# EAGLE design giant-poe-pixel-controller-v1 (EAGLE 7.7.0)

## Sheet 1 of 2
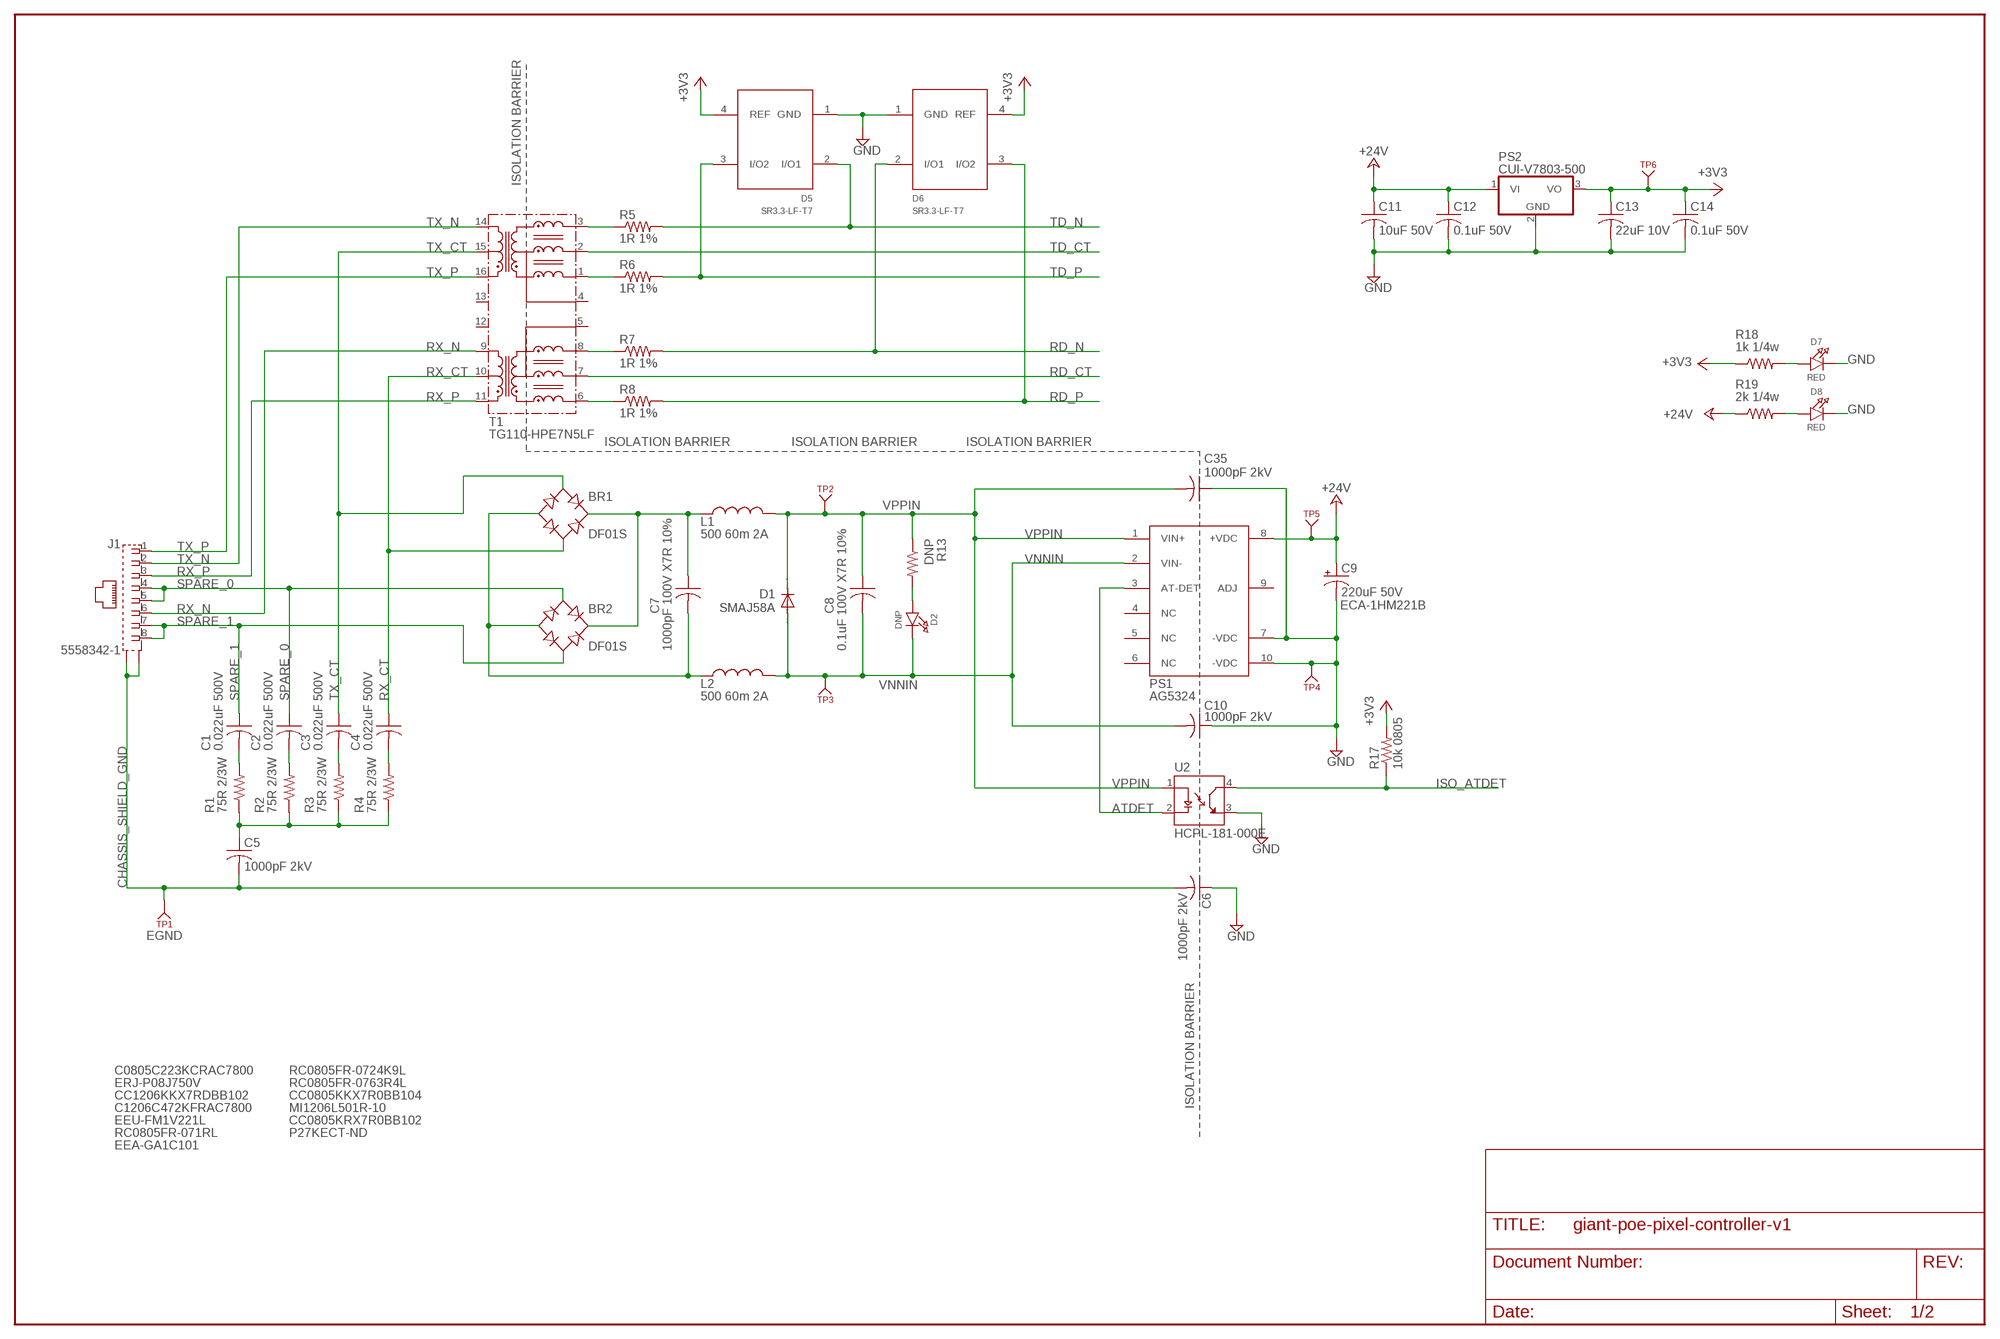
[diagram p0: schematic, sheet 1]

### Parts
BR1  DF01S  [DFS]
BR2  DF01S  [DFS]
C1  0.022uF 500V  C-USC1206  [C1206]
C2  0.022uF 500V  C-USC1206  [C1206]
C3  0.022uF 500V  C-USC1206  [C1206]
C4  0.022uF 500V  C-USC1206  [C1206]
C5  1000pF 2kV  C-USC1206K  [C1206K]
C6  1000pF 2kV  C-USC1206K  [C1206K]
C7  1000pF 100V X7R 10%  C-USC0805  [C0805]
C8  0.1uF 100V X7R 10%  C-USC0805  [C0805]
C9  220uF 50V  CPOL-USE5-10.5  [E5-10,5]
C10  1000pF 2kV  C-USC1206K  [C1206K]
C11  10uF 50V  C-USC1210K  [C1210K]
C12  0.1uF 50V  C-USC0805  [C0805]
C13  22uF 10V  C-USC1206K  [C1206K]
C14  0.1uF 50V  C-USC0805  [C0805]
C35  1000pF 2kV  C-USC1206K  [C1206K]
D1  SMAJ58A  DIODE-DO214AC  [DO214AC]
D2  DNP  LED0805_NOOUTLINE  [CHIPLED_0805_NOOUTLINE]
D5  SR3.3-LF-T7  [SOT143B]
D6  SR3.3-LF-T7  [SOT143B]
D7  RED  LED0805_NOOUTLINE  [CHIPLED_0805_NOOUTLINE]
D8  RED  LED0805_NOOUTLINE  [CHIPLED_0805_NOOUTLINE]
J1  5558342-1  [TE_5558342-1]
L1  500 60m 2A  L-USL3216C  [L3216C]
L2  500 60m 2A  L-USL3216C  [L3216C]
PS1  AG5324  [AG5324]
PS2  CUI-V7803-500  [CUI-78XX-500]
R1  75R 2/3W  R-US_R1206  [R1206]
R2  75R 2/3W  R-US_R1206  [R1206]
R3  75R 2/3W  R-US_R1206  [R1206]
R4  75R 2/3W  R-US_R1206  [R1206]
R5  1R 1%  R-US_R0805  [R0805]
R6  1R 1%  R-US_R0805  [R0805]
R7  1R 1%  R-US_R0805  [R0805]
R8  1R 1%  R-US_R0805  [R0805]
R13  DNP  R-US_R1206  [R1206]
R17  10k 0805  R-US_R0805  [R0805]
R18  1k 1/4w  R-US_R0805  [R0805]
R19  2k 1/4w  R-US_R0805  [R0805]
T1  TG110-HPE7N5LF  [RP-ULTRA]
TP1  KEYSTONE_500X  [KEYSTONE_TP500X]
TP2  KEYSTONE_500X  [KEYSTONE_TP500X]
TP3  KEYSTONE_500X  [KEYSTONE_TP500X]
TP4  KEYSTONE_500X  [KEYSTONE_TP500X]
TP5  KEYSTONE_500X  [KEYSTONE_TP500X]
TP6  KEYSTONE_500X  [KEYSTONE_TP500X]
U2  HCPL-181-000E  [SOIC254P675X240-4N]

### Nets
+3V3: C13.1 C14.1 D5.4(REF) D6.4(REF) PS2.3(VO) R17.2 R18.1 TP6.1 ; also sheet 2
+24V: C9.+ C11.1 C12.1 PS1.8(+VDC) PS2.1(VI) R19.1 TP5.1 ; also sheet 2
ATDET: PS1.3(AT-DET) U2.2(CATHODE)
CHASSIS_SHIELD_GND: C5.2 C6.2 J1.SH1(S1) J1.SH2(S2) TP1.1
GND: C6.1 C9.- C10.1 C11.2 C12.2 C13.2 C14.2 C35.1 D5.1(GND) D6.1(GND) D7.C D8.C PS1.7(-VDC) PS1.10(-VDC) PS2.2(GND) TP4.1 U2.3(EMITTER) ; also sheet 2
ISO_ATDET: R17.1 U2.4(COLLECTOR) ; also sheet 2
N$1: BR1.+ BR2.+ C7.1 L1.1
N$2: R5.1 T1.3
N$3: BR1.- BR2.- C7.2 L2.1
N$4: R6.1 T1.1
N$5: C4.2 R4.2
N$6: R7.1 T1.8
N$7: D2.A R13.2
N$13: R8.1 T1.6
N$14: C1.2 R1.2
N$15: C2.2 R2.2
N$16: C3.2 R3.2
N$17: C5.1 R1.1 R2.1 R3.1 R4.1
N$24: D7.A R18.2
N$25: D8.A R19.2
RD_CT: T1.7 ; also sheet 2
RD_N: D6.2(I/O1) R7.2 ; also sheet 2
RD_P: D6.3(I/O2) R8.2 ; also sheet 2
RX_CT: BR1.AC2 C4.1 T1.10
RX_N: J1.6 T1.9
RX_P: J1.3 T1.11
SPARE_0: BR2.AC1 C2.1 J1.4 J1.5
SPARE_1: BR2.AC2 C1.1 J1.7 J1.8
TD_CT: T1.2 ; also sheet 2
TD_N: D5.2(I/O1) R5.2 ; also sheet 2
TD_P: D5.3(I/O2) R6.2 ; also sheet 2
TX_CT: BR1.AC1 C3.1 T1.15
TX_N: J1.2 T1.14
TX_P: J1.1 T1.16
VNNIN: C8.2 C10.2 D1.A D2.C L2.2 PS1.2(VIN-) TP3.1
VPPIN: C8.1 C35.2 D1.C L1.2 PS1.1(VIN+) R13.1 TP2.1 U2.1(ANODE)
Unconnected: PS1.4(NC) PS1.5(NC) PS1.6(NC) PS1.9(ADJ) T1.4 T1.5 T1.12 T1.13

### Notes on the sheet
- ISOLATION BARRIER
- ISOLATION BARRIER | ISOLATION BARRIER | ISOLATION BARRIER
- ECA-1HM221B
- EGND
- C0805C223KCRAC7800 | RC0805FR-0724K9L
- ERJ-P08J750V | RC0805FR-0763R4L
- CC1206KKX7RDBB102 | CC0805KKX7R0BB104
- ISOLATION BARRIER
- C1206C472KFRAC7800 | MI1206L501R-10
- EEU-FM1V221L | CC0805KRX7R0BB102
- RC0805FR-071RL | P27KECT-ND
- EEA-GA1C101

## Sheet 2 of 2
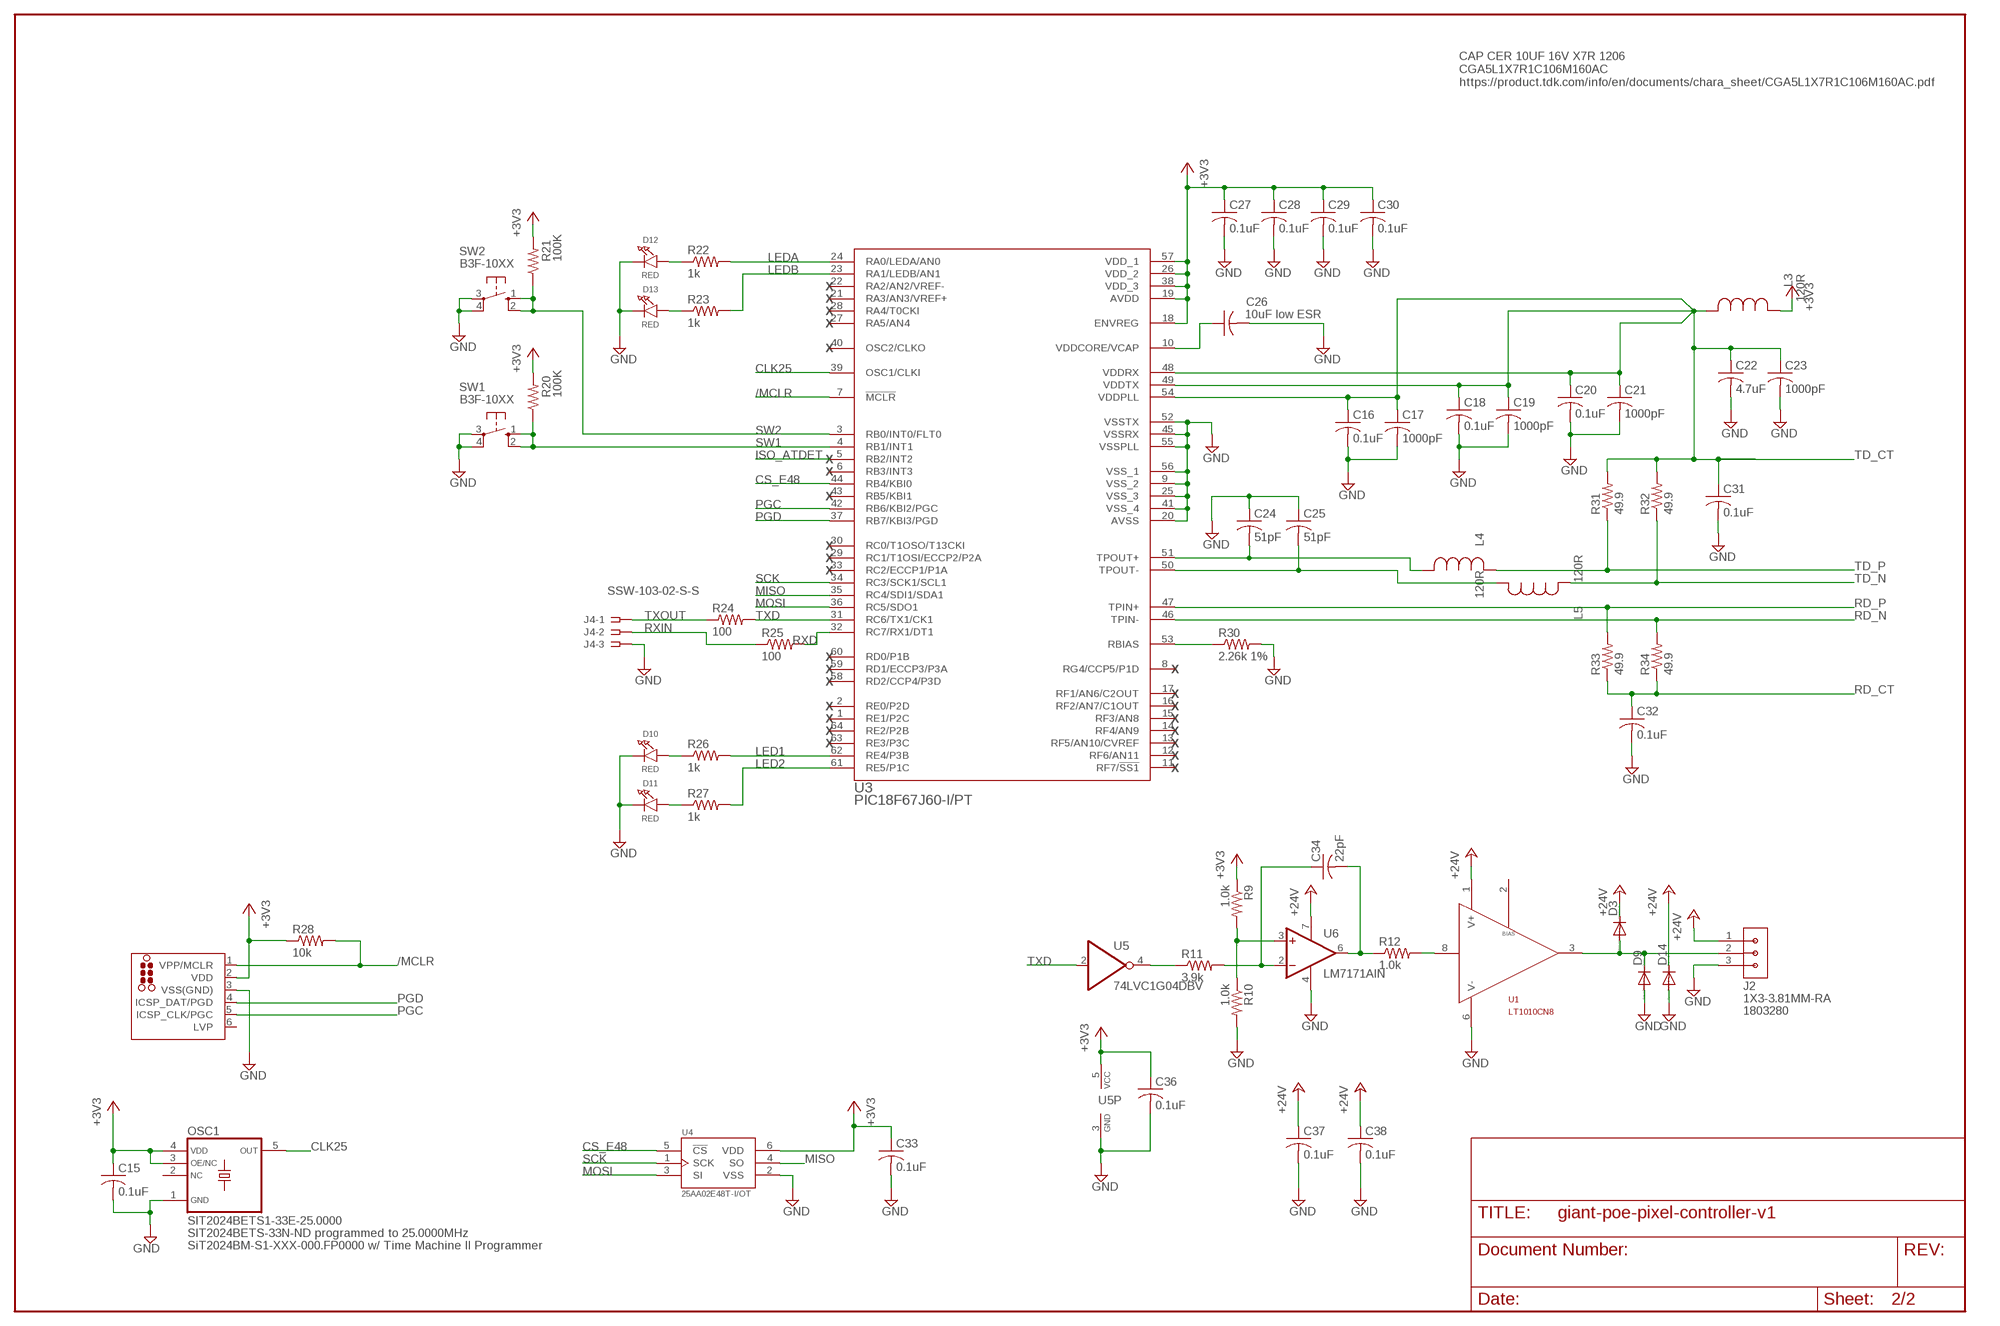
[diagram p1: schematic, sheet 2]

### Parts
C15  0.1uF  C-USC0603  [C0603]
C16  0.1uF  C-USC0805  [C0805]
C17  1000pF  C-USC0805  [C0805]
C18  0.1uF  C-USC0805  [C0805]
C19  1000pF  C-USC0805  [C0805]
C20  0.1uF  C-USC0805  [C0805]
C21  1000pF  C-USC0805  [C0805]
C22  4.7uF  C-USC0805  [C0805]
C23  1000pF  C-USC0805  [C0805]
C24  51pF  C-USC0805  [C0805]
C25  51pF  C-USC0805  [C0805]
C26  10uF low ESR  C-USC1206  [C1206]
C27  0.1uF  C-USC0603  [C0603]
C28  0.1uF  C-USC0603  [C0603]
C29  0.1uF  C-USC0603  [C0603]
C30  0.1uF  C-USC0603  [C0603]
C31  0.1uF  C-USC0805  [C0805]
C32  0.1uF  C-USC0805  [C0805]
C33  0.1uF  C-USC0603  [C0603]
C34  22pF  C-USC0805  [C0805]
C36  0.1uF  C-USC0603  [C0603]
C37  0.1uF  C-USC0603  [C0603]
C38  0.1uF  C-USC0603  [C0603]
D3  DIODE-SOD123  [SOD123]
D9  DIODE-SOD123  [SOD123]
D10  RED  LED0805_NOOUTLINE  [CHIPLED_0805_NOOUTLINE]
D11  RED  LED0805_NOOUTLINE  [CHIPLED_0805_NOOUTLINE]
D12  RED  LED0805_NOOUTLINE  [CHIPLED_0805_NOOUTLINE]
D13  RED  LED0805_NOOUTLINE  [CHIPLED_0805_NOOUTLINE]
D14  DIODE-SOD123  [SOD123]
J2  1X3-3.81MM-RA  CON-3.81MM-1X3-PHOENIX-RA  [CON-PHOENIX-3.81-1X3-RA]
J3  TC2030-MCP-NL  [TC2030-MCP-NL]
J4  SSW-103-02-S-S  [SSW-103-02-S-S]
L3  120R  MMZ1608B121CTAH0IND_1608-M  [IND_1608-M]
L4  120R  MMZ1608B121CTAH0IND_1608-M  [IND_1608-M]
L5  120R  MMZ1608B121CTAH0IND_1608-M  [IND_1608-M]
OSC1  SIT2024BETS1-33E-25.0000  SIT2024BETS1-33E-10.0000  [SOT23-5]
R9  1.0k  R-US_R0805  [R0805]
R10  1.0k  R-US_R0805  [R0805]
R11  3.9k  R-US_R0805  [R0805]
R12  1.0k  R-US_R0805  [R0805]
R20  100K  R-US_R0805  [R0805]
R21  100K  R-US_R0805  [R0805]
R22  1k  R-US_R0805  [R0805]
R23  1k  R-US_R0805  [R0805]
R24  100  R-US_R0805  [R0805]
R25  100  R-US_R0805  [R0805]
R26  1k  R-US_R0805  [R0805]
R27  1k  R-US_R0805  [R0805]
R28  10k  R-US_R0805  [R0805]
R30  2.26k 1%  R-US_R0805  [R0805]
R31  49.9  R-US_R0805  [R0805]
R32  49.9  R-US_R0805  [R0805]
R33  49.9  R-US_R0805  [R0805]
R34  49.9  R-US_R0805  [R0805]
SW1  B3F-10XX  10-XX  [B3F-10XX]
SW2  B3F-10XX  10-XX  [B3F-10XX]
U1  LT1010CN8  [DIL08]
U3  PIC18F67J60-I/PT  [TQFP64_10X10MC]
U4  25AA02E48T-I/OT  [SOT95P270X145-6N]
U5  74LVC1G04DBV  [SOT23-5]
U6  LM7171AIN  LM307D  [SO08]

### Nets
+3V3: C15.1 C27.1 C28.1 C29.1 C30.1 C33.1 C36.1 J3.2(VDD) L3.2 OSC1.3(OE/NC) OSC1.4(VDD) R9.1 R20.2 R21.2 R28.1 U3.18(ENVREG) U3.19(AVDD) U3.26(VDD_2) U3.38(VDD_3) U3.57(VDD_1) U4.6(VDD) U5.5(VCC) ; also sheet 1
+24V: C37.1 C38.1 D3.C D14.C J2.1 U1.1(V+) U6.7(V+) ; also sheet 1
/MCLR: J3.1(VPP/MCLR) R28.2 U3.7(!MCLR)
CLK25: OSC1.5(OUT) U3.39(OSC1/CLKI)
CS_E48: U3.44(RB4/KBI0) U4.5(!CS)
GND: C15.2 C16.2 C17.2 C18.2 C19.2 C20.2 C21.2 C22.2 C23.2 C24.1 C25.1 C26.2 C27.2 C28.2 C29.2 C30.2 C31.2 C32.2 C33.2 C36.2 C37.2 C38.2 D9.A D10.C D11.C D12.C D13.C D14.A J2.3 J3.3(VSS(GND)) J4.3 OSC1.1(GND) R10.2 R30.2 SW1.3(P) SW1.4(P1) SW2.3(P) SW2.4(P1) U1.6(V-) U3.9(VSS_2) U3.20(AVSS) U3.25(VSS_3) U3.41(VSS_4) U3.45(VSSRX) U3.52(VSSTX) U3.55(VSSPLL) U3.56(VSS_1) U4.2(VSS) U5.3(GND) U6.4(V-) ; also sheet 1
ISO_ATDET: U3.5(RB2/INT2) ; also sheet 1
LED1: R26.2 U3.62(RE4/P3B)
LED2: R27.2 U3.61(RE5/P1C)
LEDA: R22.2 U3.24(RA0/LEDA/AN0)
LEDB: R23.2 U3.23(RA1/LEDB/AN1)
MISO: U3.35(RC4/SDI1/SDA1) U4.4(SO)
MOSI: U3.36(RC5/SDO1) U4.3(SI)
N$8: R11.1 U5.4(O)
N$9: R30.1 U3.53(RBIAS)
N$10: D13.A R23.1
N$11: D10.A R26.1
N$18: D11.A R27.1
N$19: C34.1 R11.2 U6.2(-IN)
N$20: R9.2 R10.1 U6.3(+IN)
N$21: D12.A R22.1
N$22: C34.2 R12.1 U6.6(OUT)
N$28: D3.A D9.C J2.2 U1.3(OUTPUT)
N$29: R12.2 U1.8(INPUT)
PGC: J3.5(ICSP_CLK/PGC) U3.42(RB6/KBI2/PGC)
PGD: J3.4(ICSP_DAT/PGD) U3.37(RB7/KBI3/PGD)
RD_CT: C32.1 R33.1 R34.1 ; also sheet 1
RD_N: R34.2 U3.46(TPIN-) ; also sheet 1
RD_P: R33.2 U3.47(TPIN+) ; also sheet 1
RXD: R25.2 U3.32(RC7/RX1/DT1)
RXIN: J4.2 R25.1
SCK: U3.34(RC3/SCK1/SCL1) U4.1(SCK)
SW1: R20.1 SW1.1(S) SW1.2(S1) U3.4(RB1/INT1)
SW2: R21.1 SW2.1(S) SW2.2(S1) U3.3(RB0/INT0/FLT0)
TD_CT: C16.1 C17.1 C18.1 C19.1 C20.1 C21.1 C22.1 C23.1 C31.1 L3.1 R31.2 R32.2 U3.48(VDDRX) U3.49(VDDTX) U3.54(VDDPLL) ; also sheet 1
TD_N: L5.2 R32.1 ; also sheet 1
TD_P: L4.2 R31.1 ; also sheet 1
TDF_N: C25.2 L5.1 U3.50(TPOUT-)
TDF_P: C24.2 L4.1 U3.51(TPOUT+)
TXD: R24.2 U3.31(RC6/TX1/CK1) U5.2(I)
TXOUT: J4.1 R24.1
VDDCORE: C26.1 U3.10(VDDCORE/VCAP)
Unconnected: J3.6(LVP) OSC1.2(NC) U1.2(BIAS) U3.1(RE1/P2C) U3.2(RE0/P2D) U3.6(RB3/INT3) U3.8(RG4/CCP5/P1D) U3.11(RF7/!SS1) U3.12(RF6/AN11) U3.13(RF5/AN10/CVREF) U3.14(RF4/AN9) U3.15(RF3/AN8) U3.16(RF2/AN7/C1OUT) U3.17(RF1/AN6/C2OUT) U3.21(RA3/AN3/VREF+) U3.22(RA2/AN2/VREF-) U3.27(RA5/AN4) U3.28(RA4/T0CKI) U3.29(RC1/T1OSI/ECCP2/P2A) U3.30(RC0/T1OSO/T13CKI) U3.33(RC2/ECCP1/P1A) U3.40(OSC2/CLKO) U3.43(RB5/KBI1) U3.58(RD2/CCP4/P3D) U3.59(RD1/ECCP3/P3A) U3.60(RD0/P1B) U3.63(RE3/P3C) U3.64(RE2/P2B)

### Notes on the sheet
- CAP CER 10UF 16V X7R 1206
  CGA5L1X7R1C106M160AC 
  https://product.tdk.com/info/en/documents/chara_sheet/CGA5L1X7R1C106M160AC.pdf
- X
- X
- X
- X
- X
- X
- X
- X
- X
- X
- X
- X
- X | X
- X
- X
- X | X
- X | X
- X | X
- X | X
- X
- X
- SIT2024BETS-33N-ND programmed to 25.0000MHz
- SiT2024BM-S1-XXX-000.FP0000 w/ Time Machine II Programmer

## Library data of the parts
BR1 BR2 = rectifier:DF*S: Surface Mount Glass Passivated Bridge Rectifiers Source: Source: Comchip Bridge Rectifiers DF005S-G thru DF10S-G.pdf
C1-C8 C10 C15-C25 C27-C38 = rcl:C-US: CAPACITOR, American symbol
C9 = rcl:CPOL-US: POLARIZED CAPACITOR, American symbol
C11 = rcl:C-US: CAPACITOR, American symbol; MFR: KEMET; MFR_PART_NO: C1210C106K5RACTU
C12 C14 = rcl:C-US: CAPACITOR, American symbol; MFR: KEMET; MFR_PART_NO: C1206S104M5RACTU
C13 = rcl:C-US: CAPACITOR, American symbol; MFR: KEMET; MFR_PART_NO: C1206C226K8RAC7800
C26 = resistor:C-US: CAPACITOR, American symbol
D1 D3 D9 D14 = diode:DIODE-: DIODE
D2 D7 D8 D10-D13 = microbuilder:LED: LED 0603 - 0603 Surface Mount Package 2mA: Green LED - Low Power (3.9mcd, 2ma, 1.7Vf) - Digikey: 475-2709-2-ND Orange LED - Low Power (9.8mcd, 2ma, 1.8Vf) - Digikey: 475-1194-2-ND Red LED - Low Power (5mcd, 2ma, 1.8Vf) - Digikey: 475-1195-2-ND Yellow LED - Low Power (7mcd, 2ma, 1.8Vf) - Digikey: 475-1196-2-ND 5mA: Blue LED - Low Power (17mcd, 5ma, 2.9Vf) - Digikey: LNJ937W8CRACT-ND 0805 - 0805 Surface Mount Package 2mA: Red LED (8.8mcd, 2mA, 1.8Vf, Clear) - Low Power [Digikey: 475-2510-1-ND] Green LED (5mcd, 2mA, 1.8Vf, Clear) - Low Power [Digikey: 475-2730-1-ND] Yellow LED (11.3mcd, 2mA, 1.8Vf, Clear) - Low Power [Digikey: 475-2555-1-ND] 20mA: Red LED (104mcd, 20mA, Diffused) - LS R976 [Digikey: 475-1278-6-ND] Red LED (12mcd, 20mA, 2.0Vf, Clear) - APT2012EC [Digikey: 754-1128-1-ND] Green LED (15mcd, 20mA, 2.2Vf, Clear) - APT2012GC [Digikey: 754-1131-1-ND] Orange LED (160mcd, 20mA, 2.1Vf, Clear) - APT2012SECK [Digikey: 754-1130-1-ND] 1206 - 1206 Surface Mount Package Green LED (26mcd, 20mA, Diffused) - LG N971 [Digikey: 475-1407-6-ND] Red LED (15mcd, 20mA, Diffused) - LH N974 [Digikey: 475-1416-6-ND] Cree - Cree High-Power Surface Mount LEDs XPEBWT-L1-0000-00D50 - White 111lm 350mA 2.9Vf 6200K 110° XTEAWT-00-0000-00000LEE3 - White 114lm 350mA 2.85Vf 5000K 115° Everlight - Everlight 45-21 Series Surface Mount LEDs 45-21/QK2C-B2832AC2CB2/2T - Warm White 2000mcd 20mA 3.25Vf 3050K 120° 45-21/LK2C-B38452C4CB2/2T - Nuetral White 2000mcd 20mA 3.25Vf 4150K 120° 45-21/LK2C-B50634C6CB2/2T - Cold White 2200mcd 20mA 3.25Vf 5650K 120° PLCC2 Reverse Mount LS T77K-J1L2-1-0-2-R18-Z - Red 11.25mcd 2mA 1.8Vf 630nm 120° LO T77K-L1M2-24-Z - Orange 19.6mcd 2mA 1.8Vf 606nm 120° LY T77K-K2M1-26-Z - Yellow 15.7mcd 2mA 1.8Vf 587nm 120°
D5 D6 = protek-devices:SR3.3-LF-T7
J1 = 5558342-1:5558342-1: CONN MOD JACK 8P8C R/A SHIELDED; COMMENT: 5558342-1; DESCRIPTION: Conn RJ-45 F 8 POS 2.54mm Solder RA Thru-Hole 8 Terminal 1 Port Cat 5 Box/Tray; DIGI-KEY_PART_NUMBER: A31466-ND; DIGI-KEY_PURCHASE_URL: https://www.digikey.com/product-detail/en/te-connectivity-amp-connectors/5558342-1/A31466-ND/769610?utm_source=snapeda&utm_medium=aggregator&utm_campaign=symbol; EU_ROHS_COMPLIANCE: Compliant; MF: TE Connectivity; MP: 5558342-1; PACKAGE: None; TE_PURCHASE_URL: https://www.te.com/usa-en/product-5558342-1.html?te_bu=Cor&te_type=disp&te_campaign=seda_glo_cor-seda-global-disp-prtnr-fy19-seda-model-bom-cta_sma-317_1&elqCampaignId=32493
J2 = 0GlenConnectors:CON-3.81MM-1X3-PHOENIX-RA; MATES_WITH: 1803581; MFR: PHOENIX; MFR_PART_NO: 1803280
J3 = tag-connect:TC2030: TAG-CONNECT ICSP Connector Manufacturer: Tag-Connect <http://www.tag-connect.com> Cable for easy In-Circuit Serial Programming. Designed for Microchip ICD2, suitable for many others. Two variants - one "with legs" (for hands-free fit on PCB) and another "without legs" for quick programming. PAD Description 1 MCLR/Vpp 2 Vdd 3 GND 4 PGD (ISPDAT) 5 PGC (ISPCLK) 6 nc (used for LVP) ©2009 ROFA.cz - modified and updated by Robert Darlington ‹rdarlington@gmail.com›
J4 = con-samtec:SSW-103-02-S-S: THROUGH-HOLE .025" SQ POST SOCKET Source: Samtec SSW.pdf; MPN: SSW-103-02-S-S; OC_FARNELL: unknown; OC_NEWARK: 11P9367
L1 L2 = rcl:L-US: INDUCTOR, American symbol
L3-L5 = MMZ1608B121CTAH0:MMZ1608B121CTAH0; BUILT_BY: EMA_UL_Team; MANUFACTURER_PART_NUMBER: MMZ1608B121CTAH0; VENDOR: TDK
OSC1 = Glen-SiTime:SIT2024BETS1-33E-10.0000
PS1 = silvertel:AG5324
PS2 = GlenPartsLibrary:CUI-V7803-500
R1-R13 R18-R28 R30-R34 = rcl:R-US_: RESISTOR, American symbol
R17 = resistor:R-US_: RESISTOR, American symbol
SW1 SW2 = switch-omron:10-XX: OMRON SWITCH
T1 = halo-rp-ultra-magnetics:TG110-HPE7N5LF
TP1-TP6 = 0GlenConnectors:KEYSTONE_500X
U1 = GlenPartsLibrary:LT1010CN8
U2 = HCPL-181-000E:HCPL-181-000E: Optocoupler; SMD; Channels: 1; Out: transistor; Uinsul: 3.75kV; SO4; DESCRIPTION: Optocoupler; SMD; Channels: 1; Out: transistor; Uinsul: 3.75kV; SO4; DIGI-KEY_PART_NUMBER: 516-1646-1-ND; DIGI-KEY_PURCHASE_URL: https://www.digikey.com/product-detail/en/broadcom-limited/HCPL-181-000E/516-1646-1-ND/825340?utm_source=snapeda&utm_medium=aggregator&utm_campaign=symbol; MF: Broadcom Limited; MP: HCPL-181-000E; PACKAGE: SO-4 Broadcom
U3 = pic18f67j60:PIC18F67J60-I/PT; MANUFACTURER_PART_NUMBER: PIC18F67J60IPT; VENDOR: Microchip
U4 = 25AA02E48T-I_OT:25AA02E48T-I/OT: 25AA02E48 Series 2 Kbit (256 x 8) 5.5 V SMT SPI Bus Serial EEPROM - SOT-23-6; DESCRIPTION: 25AA02E48 Series 2 Kbit _256 x 8_ 5.5 V SMT SPI Bus Serial EEPROM - SOT-23-6; DIGI-KEY_PART_NUMBER: 25AA02E48T-I/OTCT-ND; DIGI-KEY_PURCHASE_URL: https://www.digikey.com/product-detail/en/microchip-technology/25AA02E48T-I-OT/25AA02E48T-I-OTCT-ND/2060055?utm_source=snapeda&utm_medium=aggregator&utm_campaign=symbol; MF: Microchip; MP: 25AA02E48T-I/OT; PACKAGE: SOT-23-6 Microchip
U5 = 74xx-little-de:74*1G04: INVERTER Gate
U6 = linear:LM307: OP AMP

## Board
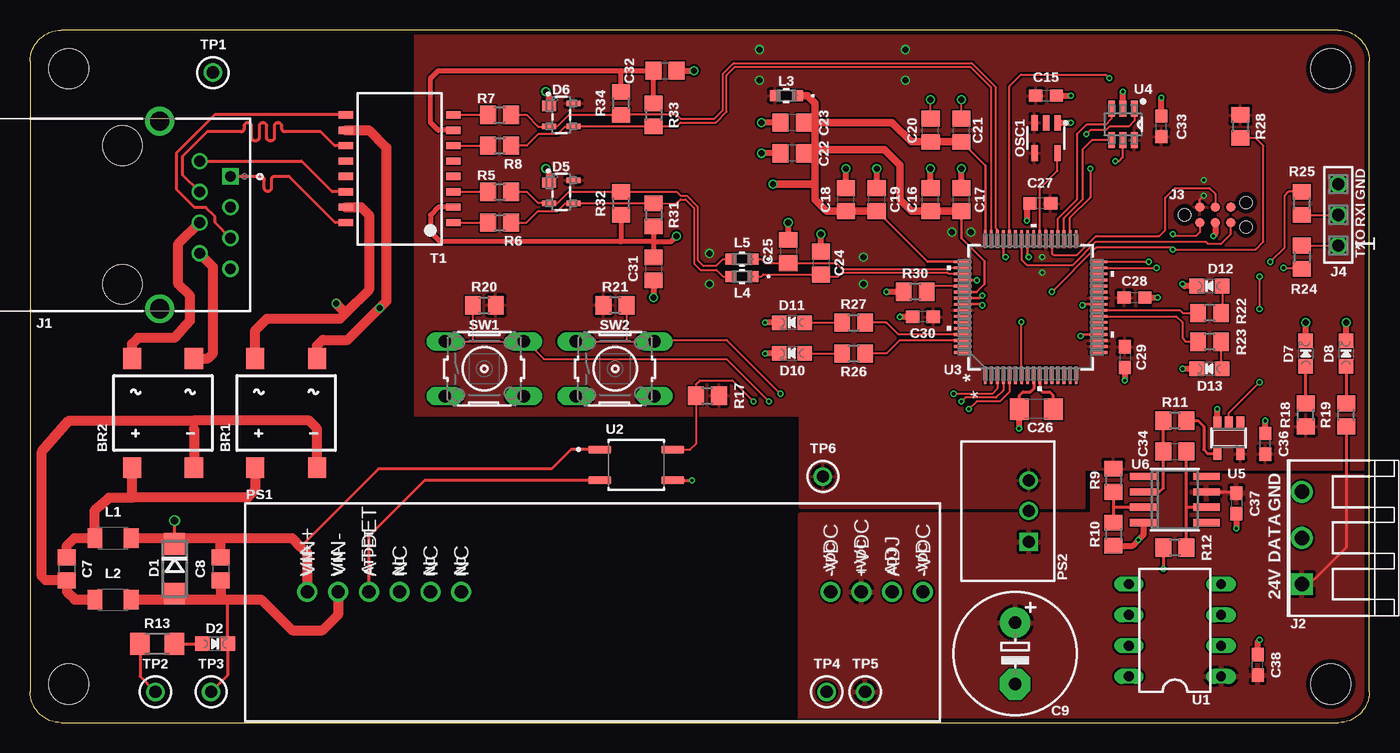
[diagram p2: board, top side]
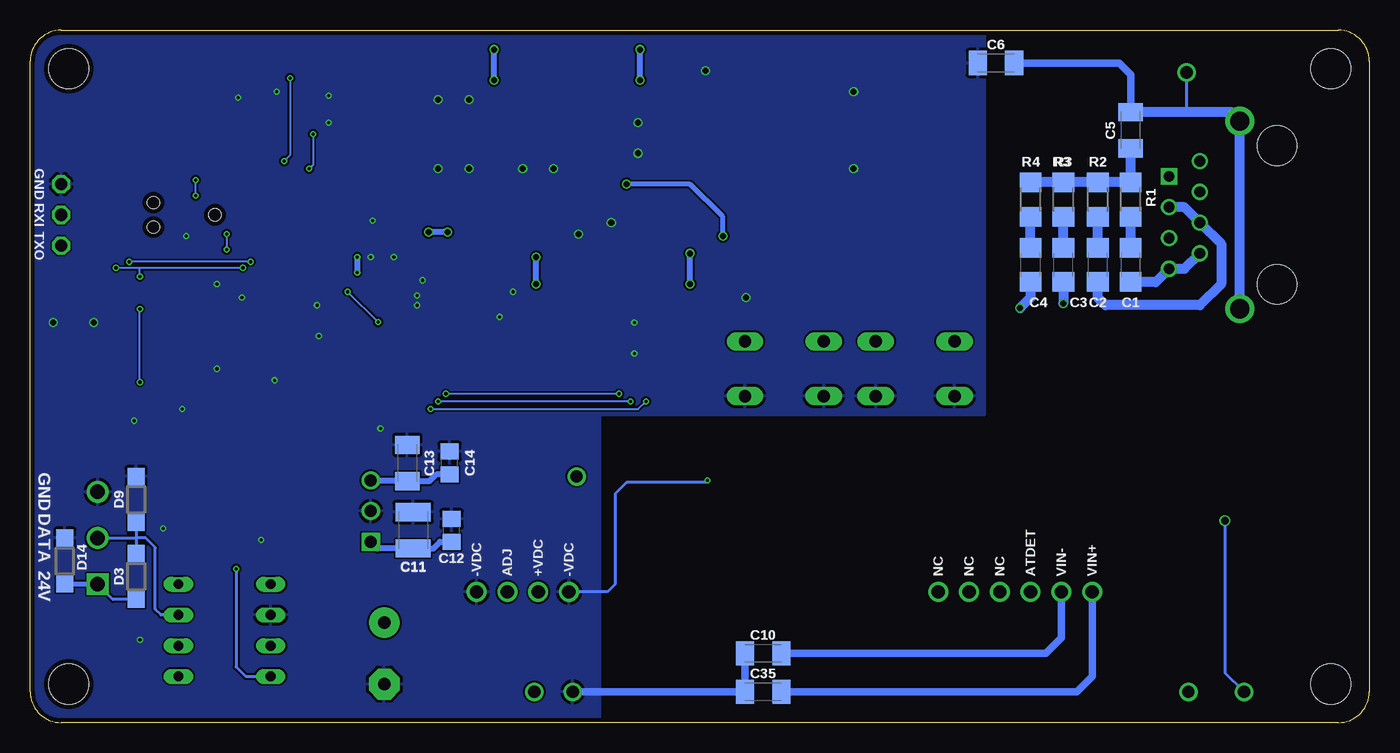
[diagram p3: board, bottom side, seen from below]

Size 110.49 x 57.15 mm. Coordinates in mm from the lower left corner, seen from the top.
Outline: 2.54,0 107.95,0 arc90 110.49,2.54 110.49,54.61 arc90 107.95,57.15 2.54,57.15 arc90 0,54.61 0,2.54 arc90 2.54,0
Copper layers (1*16): Top 0.035559375mm / dielectric 1.6mm / Bottom 0.035559375mm
Design rules "oshpark-2layer-2018": minimum track width 6mil, minimum drill 10mil, track to track 6mil, track to pad 6mil, pad to pad 6mil, via to via 6mil, smd to smd 6mil, copper to edge 15mil, drill to drill 6mil, minimum pad ring 5mil, minimum via ring 5mil, stop-mask expansion 2.5mil, vias tented up to drill 0mil, thermal gap 10mil
Holes 3.3 mm at 3.17,3.17 107.31,53.98 3.17,53.98 107.31,3.17

### Footprints (pad centres in the part's own frame; a part is rotated, then mirrored left to right if it is on the bottom)
DFS = smd 1.5 x 1.7: + -2.55,-4.5; - 2.55,-4.5; AC1 -2.55,4.5; AC2 2.55,4.5
C1206 = smd 1.6 x 1.8: 1 -1.4,0; 2 1.4,0
C1206K = smd 1.5 x 2: 1 -1.5,0; 2 1.5,0
C0805 = smd 1.3 x 1.5: 1 -0.95,0; 2 0.95,0
E5-10,5 = drill 1.016 pad 2.54: + -2.54,0 | drill 1.016 pad 2.54 octagon: - 2.54,0
C1210K = smd 1.5 x 2.9: 1 -1.5,0; 2 1.5,0
C0603 = smd 1.1 x 1: 1 -0.85,0; 2 0.85,0
DO214AC = smd 1.8 x 1.7: A 2.05,0; C -2.05,0
CHIPLED_0805_NOOUTLINE = smd 1.2 x 1.2: A 0,-1.05; C 0,1.05
SOD123 = smd 1.4 x 1.4: A 1.9,0; C -1.9,0
SOT143B = smd 0.838 x 1.168: 1 -0.747,-1.016 | smd 0.432 x 1.168: 2 0.95,-1.016; 3 0.95,1.016; 4 -0.95,1.016
TE_5558342-1 = drill 0.89 square: 1 -3.175,8.89 | drill 0.89: 2 -4.445,6.35; 3 -1.905,6.35; 4 0.635,6.35; 5 -0.635,8.89; 6 1.905,8.89; 7 4.445,8.89; 8 3.175,6.35 | drill 1.58: SH1 -7.745,3.05; SH2 7.745,3.05 | hole 3.25: -5.715,0; 5.715,0
CON-PHOENIX-3.81-1X3-RA = drill 1.2 square: 1 0,0 | drill 1.2: 2 3.81,0; 3 7.62,0
TC2030-MCP-NL = smd 0.787 x 0.787: 1 1.27,-0.635; 2 1.27,0.635; 3 2.54,-0.635; 4 2.54,0.635; 5 3.81,-0.635; 6 3.81,0.635 | hole 0.991: 0,0; 5.08,-1.016; 5.08,1.016
SSW-103-02-S-S = drill 1 pad 1.5 octagon: 1 -2.54,0; 2 0,0; 3 2.54,0
L3216C = smd 1.2 x 1.6: 1 -1.5,0; 2 1.5,0
IND_1608-M = smd 0.859 x 0.902: 1 -0.929,0; 2 0.929,0
SOT23-5 = smd 1.3 x 0.55: 1 -1.25,0.95; 2 -1.25,0; 3 -1.25,-0.95; 4 1.25,-0.95; 5 1.25,0.95
AG5324 = drill 1.1: 1 0,0; 2 2.54,0; 3 5.08,0; 4 7.62,0; 5 10.16,0; 6 12.7,0; 7 43.18,0; 8 45.72,0; 9 48.26,0; 10 50.8,0
CUI-78XX-500 = drill 1 square: 1 0,0 | drill 1: 2 2.54,0; 3 5.08,0
R1206 = smd 1.6 x 1.803: 1 -1.422,0; 2 1.422,0
R0805 = smd 1.3 x 1.5: 1 -0.95,0; 2 0.95,0
B3F-10XX = drill 1.016 long: 1 -3.251,2.261; 2 3.251,2.261; 3 -3.251,-2.261; 4 3.251,-2.261
RP-ULTRA = smd 0.6 x 1.2: 1 -4.445,-4.445; 2 -3.175,-4.445; 3 -1.905,-4.445; 4 -0.635,-4.445; 5 0.635,-4.445; 6 1.905,-4.445; 7 3.175,-4.445; 8 4.445,-4.445; 9 4.445,4.445; 10 3.175,4.445; 11 1.905,4.445; 12 0.635,4.445; 13 -0.635,4.445; 14 -1.905,4.445; 15 -3.175,4.445; 16 -4.445,4.445
KEYSTONE_TP500X = drill 1.016: 1 0,0
DIL08 = drill 0.813 long: 1 -3.81,-3.81; 2 -1.27,-3.81; 3 1.27,-3.81; 4 3.81,-3.81; 5 3.81,3.81; 6 1.27,3.81; 7 -1.27,3.81; 8 -3.81,3.81
SOIC254P675X240-4N = smd 1.89 x 0.59: 1 -3.01,1.27; 2 -3.01,-1.27; 3 3.01,-1.27; 4 3.01,1.27
TQFP64_10X10MC = smd 1.473 x 0.229: 1 -5.613,3.75; 2 -5.613,3.25; 3 -5.613,2.75; 4 -5.613,2.25; 5 -5.613,1.75; 6 -5.613,1.25; 7 -5.613,0.75; 8 -5.613,0.25; 9 -5.613,-0.25; 10 -5.613,-0.75; 11 -5.613,-1.25; 12 -5.613,-1.75; 13 -5.613,-2.25; 14 -5.613,-2.75; 15 -5.613,-3.25; 16 -5.613,-3.75; 33 5.613,-3.75; 34 5.613,-3.25; 35 5.613,-2.75; 36 5.613,-2.25; 37 5.613,-1.75; 38 5.613,-1.25; 39 5.613,-0.75; 40 5.613,-0.25; 41 5.613,0.25; 42 5.613,0.75; 43 5.613,1.25; 44 5.613,1.75; 45 5.613,2.25; 46 5.613,2.75; 47 5.613,3.25; 48 5.613,3.75 | smd 0.229 x 1.473: 17 -3.75,-5.613; 18 -3.25,-5.613; 19 -2.75,-5.613; 20 -2.25,-5.613; 21 -1.75,-5.613; 22 -1.25,-5.613; 23 -0.75,-5.613; 24 -0.25,-5.613; 25 0.25,-5.613; 26 0.75,-5.613; 27 1.25,-5.613; 28 1.75,-5.613; 29 2.25,-5.613; 30 2.75,-5.613; 31 3.25,-5.613; 32 3.75,-5.613; 49 3.75,5.613; 50 3.25,5.613; 51 2.75,5.613; 52 2.25,5.613; 53 1.75,5.613; 54 1.25,5.613; 55 0.75,5.613; 56 0.25,5.613; 57 -0.25,5.613; 58 -0.75,5.613; 59 -1.25,5.613; 60 -1.75,5.613; 61 -2.25,5.613; 62 -2.75,5.613; 63 -3.25,5.613; 64 -3.75,5.613
SOT95P270X145-6N = smd 1.321 x 0.559: 1 -1.295,0.94; 2 -1.295,0; 3 -1.295,-0.94; 4 1.295,-0.94; 5 1.295,0; 6 1.295,0.94
SOT23-5' = smd 0.69 x 0.99: 1 -0.95,-1.29; 2 0,-1.29; 3 0.95,-1.29; 4 0.95,1.3; 5 -0.95,1.3
SO08 = smd 0.6 x 2.2: 1 -1.905,-2.6; 2 -0.635,-2.6; 3 0.635,-2.6; 4 1.905,-2.6; 5 1.905,2.6; 6 0.635,2.6; 7 -0.635,2.6; 8 -1.905,2.6

### Placement (x,y rotation side)
BR1  21.11,25.56 0 top
BR2  10.95,25.56 0 top
C1  19.68,37.78 90 bottom
C2  22.38,37.78 90 bottom
C3  25.24,37.78 90 bottom
C4  27.94,37.78 90 bottom
C5  19.68,48.9 90 bottom
C6  30.8,54.45 0 bottom
C7  3.02,12.7 270 top
C8  15.72,12.7 270 top
C9  81.28,5.71 270 top
C10  50.01,5.71 0 bottom
C11  78.9,15.88 90 bottom
C12  75.72,15.88 90 bottom
C13  79.38,21.43 90 bottom
C14  75.88,21.43 90 bottom
C15  83.82,51.75 0 top
C16  74.3,43.18 90 top
C17  76.83,43.18 90 top
C18  67.31,43.18 90 top
C19  69.85,43.18 90 top
C20  74.3,48.9 90 top
C21  76.83,48.9 90 top
C22  62.87,46.99 180 top
C23  62.87,49.53 180 top
C24  65.25,37.94 270 top
C25  62.55,38.89 270 top
C26  83.03,25.88 180 top
C27  83.34,42.86 180 top
C28  91.12,35.08 0 top
C29  90.33,30.16 270 top
C30  73.66,33.5 180 top
C31  51.44,37.47 270 top
C32  52.39,53.82 0 top
C33  93.34,49.21 90 top
C34  94.46,22.38 0 top
C35  50.01,2.54 0 bottom
C36  101.92,23.02 90 top
C37  99.54,18.1 270 top
C38  101.28,4.76 90 top
D1  11.91,12.7 270 top
D2  15.24,6.51 270 top
D3  101.76,12.06 90 bottom
D5  43.81,43.81 270 top
D6  43.81,50.16 270 top
D7  105.25,30.48 0 top
D8  108.58,30.48 0 top
D9  101.76,18.41 90 bottom
D10  62.87,30.48 90 top
D11  62.87,33.02 90 top
D12  97.31,36.04 90 top
D13  97.31,29.21 90 top
D14  107.63,13.34 90 bottom
J1  7.62,41.91 270 top
J2  104.93,11.43 90 top
J3  95.25,41.91 0 top
J4  107.95,41.91 90 top
L1  6.83,15.24 0 top
L2  6.83,10.16 0 top
L3  62.39,51.75 180 top
L4  58.74,36.83 180 top
L5  58.74,38.26 180 top
OSC1  83.82,48.26 270 top
PS1  22.86,10.79 0 top
PS2  82.39,14.92 90 top
R1  19.68,43.18 270 bottom
R2  22.38,43.18 270 bottom
R3  25.24,43.18 270 bottom
R4  27.94,43.18 270 bottom
R5  38.73,43.81 0 top
R6  38.73,41.27 0 top
R7  38.73,50.16 0 top
R8  38.73,47.62 0 top
R9  89.38,20 270 top
R10  89.38,15.56 270 top
R11  94.46,24.92 180 top
R12  94.46,14.45 180 top
R13  10.48,6.51 0 top
R17  55.88,26.99 0 top
R18  105.25,25.4 90 top
R19  108.58,25.4 90 top
R20  37.47,34.45 0 top
R21  48.26,34.45 180 top
R22  97.31,33.81 180 top
R23  97.31,31.43 180 top
R24  104.93,38.42 270 top
R25  104.93,42.86 90 top
R26  67.94,30.48 0 top
R27  67.94,33.02 0 top
R28  99.85,49.21 270 top
R30  73.03,35.56 180 top
R31  51.44,41.91 270 top
R32  48.74,42.86 270 top
R33  51.44,50.16 270 top
R34  48.74,51.12 270 top
SW1  37.47,29.21 0 top
SW2  48.26,29.21 0 top
T1  30.48,45.72 90 top
TP1  15.08,53.66 0 top
TP2  10.32,2.54 0 top
TP3  14.92,2.54 90 top
TP4  65.72,2.54 0 top
TP5  68.9,2.54 0 top
TP6  65.41,20.32 0 top
U1  94.46,7.62 90 top
U2  50.01,21.27 0 top
U3  82.55,34.29 90 top
U4  90.17,49.37 270 top
U5  74LVC1G04DBV  [SOT23-5']  98.9,23.5 180 top
U6  94.46,18.41 270 top

### Tracks (layer width: path | path; a pad name or v marks a point on that pad's centre or on a via)
+3V3  (via drill 0.25, 0.5)
  Top 0.152: J3.2 96.52,43.18 v96.84,43.5
  Bottom 0.152: v96.84,43.5 v96.84,44.77
  Bottom 0.508: v60.17,53.02 v60.17,55.56 | v76.04,40.48 v77.63,40.48 | v56.04,36.2 v56.04,38.73 | v68.74,36.2 v68.74,38.42 | v83.5,38.42 v83.5,37.15 | v72.23,53.02 v72.23,55.56 | PS2.3 79.45,20 C13.1 77.54,19.93 76.99,20.48 C14.1
  pour Top (isolate 0.152, rank 2): 31.75,57.15 31.75,25.4 63.5,25.4 63.5,17.78 87,17.78 87,20.95 110.49,20.95 110.49,57.15
+24V
  Top 0.254: U6.7 99.43,19.05 C37.1 | R19.1 108.58,14.45 105.57,11.44
  Bottom 0.254: D3.C 103.67,10.16 J2.1
  Bottom 0.305: C12.1
  Bottom 0.406: D14.C J2.1
  Bottom 0.508: PS2.1 81.84,14.38 C11.1 77.22,14.38 76.68,14.92 C12.1
  pour Top (isolate 0.152): 63.5,0 110.49,0 110.49,20.32 87.63,20.32 87.63,17.14 63.5,17.14
/MCLR  (via drill 0.25)
  Top 0.152: U3.7 v81.8,33.06 | J3.1 96.52,40.48 96.2,40.16 94.46,40.16 v94.3,40.32 | v84.3,35.56 87.95,39.21 94.14,39.21 v94.3,39.05 101.12,39.05 101.76,39.69 101.76,47.62 101.12,48.26 R28.2
  Bottom 0.152: v94.3,40.32 v94.3,39.05 | v81.8,33.06 v84.3,35.56
ATDET
  Top 0.254: PS1.3 27.94,15.4 32.54,20 U2.2
CHASSIS_SHIELD_GND
  Bottom 0.254: TP1.1 15.08,50.55 15.24,50.4
  Bottom 0.61: C6.2 20.64,54.45 19.68,53.5 C5.2
  Bottom 0.813: C5.2 15.24,50.4 11.41,50.4 J1.SH1 J1.SH2
CLK25
  Top 0.152: U3.39 83.3,44.09 84.77,45.56 OSC1.5
  Top 0.254: OSC1.5
CS_E48  (via drill 0.25)
  Top 0.152: U3.44 80.8,52.54 81.76,53.5 88.74,53.5 v89.06,53.18 | v89.53,46.35 89.85,46.35 90.17,46.67 U4.5
  Bottom 0.152: v89.06,53.18 89.06,46.83 v89.53,46.35
GND  (via drill 0.25, 0.5)
  Top 0.152: C20.2 v74.3,51.44 | C21.2 v76.83,51.44 | 85.86,49.51 v85.88,49.53 | C27.2 82.39,42.86 82.23,42.7
  Top 0.203: U3.20 86.81,32.04 v86.68,31.91 | U3.25 86.93,34.54 v86.84,34.45 | U3.41 82.3,38.51 v82.39,38.42 | U3.45 80.3,38.6 v80.49,38.42 | U3.52 78.08,36.54 v78.11,36.51 | U3.55 78.31,35.04 v78.58,35.24 | U3.56 78.49,34.54 v78.58,34.45
  Top 0.229: U3.9 82.8,27.55
  Top 0.254: C26.2 81.63,27.02 81.92,27.3 82.55,27.3 82.8,27.55 | U2.3 v54.61,20
  Top 0.508: C17.2 v76.83,45.72 | C16.2 v74.3,45.72 | C19.2 v69.85,45.72 | C18.2 v67.31,45.72 | C23.2 v60.33,49.53 | C22.2 v60.33,46.99 | C32.2 v54.77,53.82 | D6.1 42.8,51.82 v42.55,52.07 | D5.1 42.8,45.47 v42.55,45.72 | C25.1 v62.55,41.27 | C24.1 v65.25,40.32 | D7.C v105.25,33.02 | D8.C v108.58,33.02 | C31.2 v51.44,35.08 | D10.C v60.64,30.48 | D11.C v60.64,33.02 | R30.2 v70.64,35.56 | OSC1.1 85.86,49.51 | U4.2 v90.17,52.07 | C33.2 v93.34,51.59 | J3.3 97.79,40.32 v97.63,40.16 | C28.2 v93.03,35.08 | C29.2 v90.33,28.26 | C30.2 v71.75,33.5 | 82.23,42.7 v82.23,41.43 | C15.2 v85.88,51.75 | D12.C 95.25,36.04 v95.09,36.2 | D13.C v95.09,29.21 | C26.2 81.6,25.85 v81.6,24.29 | C38.2 101.28,6.67 v101.44,6.83 | R10.2 90.97,14.61 v91.44,15.08 91.86,15.5 U6.4 | C37.2 v99.54,16.03 | U5.3 v97.95,25.87 v97.95,25.88 | C36.2 v101.92,24.92
  Bottom 0.254: v54.61,20 54.77,19.84 61.28,19.84 62.23,18.89 62.23,11.43 62.87,10.79 PS1.7
  Bottom 0.61: C10.1 C35.1 TP4.1
  pour Bottom (isolate 0.152): 31.75,57.15 31.75,25.4 63.5,25.4 63.5,0 110.49,0 110.49,57.15
ISO_ATDET  (via drill 0.25)
  Top 0.152: U3.5 80.8,27.3 80.01,26.51 78.11,26.51 v77.47,25.88 | U2.4 54.45,22.54 54.93,23.02 R17.1 | 54.93,27.46 R17.1 | v59.69,26.51 57.94,28.26 55.24,28.26 54.93,27.94 R17.1
  Bottom 0.152: v77.47,25.88 60.33,25.88 v59.69,26.51
LED1
  Top 0.152: U3.62 71.7,31.54 70.64,30.48 R26.2
LED2
  Top 0.152: U3.61 71.62,32.04 70.64,33.02 R27.2
LEDA
  Top 0.152: U3.24 94.86,34.04 95.09,33.81 R22.2
LEDB
  Top 0.152: U3.23 94.57,33.54 95.09,33.02 95.09,31.75 95.41,31.43 R23.2
MISO
  Top 0.152: 89.22,48.06 U4.4 87.61,48.08 86.84,47.31 86.84,43.18 85.3,41.64 U3.35
MOSI
  Top 0.152: U4.3 89.2,50.64 89.2,49.84 88.74,49.37 87.15,49.37 86.36,48.58 86.36,43.18 84.8,41.62 U3.36
N$1
  Top 0.61: 8.41,21.05 BR2.+
  Top 0.813: 8.41,18.57 8.41,21.05 | BR1.+ 18.56,19.2 17.94,18.57 8.41,18.57 | C7.1 3.02,14.61 3.65,15.24 L1.1 5.33,17.55 6.35,18.41 6.51,18.57 8.41,18.57
N$2
  Top 0.152: T1.3 R5.1
N$3
  Top 0.61: 13.49,24.92 13.5,24.28
  Top 0.813: 13.5,24.28 BR2.- | BR1.- 23.66,24.28 23.02,24.92 13.49,24.92 3.17,24.92 0.95,22.38 0.95,12.06 1.27,11.75 C7.2 3.02,10.79 3.65,10.16 L2.1
N$4
  Top 0.152: T1.1 R6.1
N$5
  Bottom 0.813: C4.2 R4.2
N$6
  Top 0.152: T1.8 R7.1
N$7
  Top 0.254: R13.2 D2.A
N$8
  Top 0.254: R11.1 96.36,24.92 96.84,24.45 96.84,22.54 97.19,22.2 U5.4
N$9
  Top 0.152: U3.53 74.45,36.04 R30.1
N$10
  Top 0.152: R23.1 98.26,29.31 D13.A
N$11
  Top 0.152: D10.A R26.1
N$13
  Top 0.152: T1.6 R8.1
N$14
  Bottom 0.813: C1.2 R1.2
N$15
  Bottom 0.813: C2.2 R2.2
N$16
  Bottom 0.813: C3.2 R3.2
N$17
  Bottom 0.813: R4.1 R3.1 R2.1 R1.1 C5.1
N$18
  Top 0.152: D11.A R27.1
N$19
  Top 0.254: U6.2 93.19,19.05 93.5,19.37 C34.1 R11.2
N$20
  Top 0.254: R9.2 89.38,17.78 | 89.38,17.78 R10.1 | U6.3 89.38,17.78
N$21
  Top 0.152: D12.A 98.36,33.91 R22.1
N$22
  Top 0.254: R12.1 95.41,17.78 | 95.41,17.78 C34.2 | U6.6 95.41,17.78
N$24
  Top 0.254: R18.2 D7.A
N$25
  Top 0.254: D8.A R19.2
N$28
  Bottom 0.254: D9.C 101.76,15.24 | 101.76,15.24 D3.A | J2.2 101.76,15.24 | U1.3 99.69,8.89 100.17,9.37 100.17,14.45 100.97,15.24 101.76,15.24
N$29  (via drill 0.25)
  Top 0.254: R12.2 v93.51,12.7 v93.5,12.7
  Bottom 0.254: v93.5,12.7 93.5,4.6 92.71,3.81 U1.8
PGC
  Top 0.152: U3.42 81.8,38.22 82.23,37.78 86.04,37.78 87.95,39.69 97,39.69 97.16,39.53 98.27,39.53 99.06,40.32 J3.5
PGD
  Top 0.152: U3.37 84.3,38.73 84.45,38.58 86.36,38.58 87.95,40.16 93.19,40.16 93.66,40.64 93.66,43.34 94.46,44.13 97.31,44.13 97.79,43.66 J3.4
RD_CT
  Top 0.406: T1.7 33.66,48.9 33.02,49.53 33.02,53.18 33.66,53.82 48.74,53.82 | 48.74,53.82 C32.1 R33.1 | R34.1 48.74,53.82
RD_N
  Top 0.152: R7.2 40.96,50.16 41.91,49.21 D6.2 43.5,49.22 44.45,50.16 R34.2 | 49.06,50.48 49.06,50.17 | 49.06,50.17 49.05,50.16 | U3.46 79.8,40.69 79.69,40.8 79.69,52.44 77.69,54.45 58.04,54.45 57.16,53.56 57.16,50.55 56.45,49.84 53.66,49.84 53.33,50.16 R34.2 | R34.2 49.06,50.17
RD_P
  Top 0.152: U3.47 79.3,52.41 77.57,54.14 58.17,54.14 57.46,53.44 57.46,50.42 56.58,49.54 53.66,49.54 53.33,49.21 53.33,49.22 R33.2 D6.3 44.13,49.21 43.5,48.58 41.91,48.58 40.96,47.62 R8.2
RX_CT  (via drill 0.5)
  Top 0.813: T1.10 27.94,48.9 29.37,47.47 29.37,34.77 v28.81,34.21 26.19,31.59 24.13,31.59 23.65,31.11 23.65,30.05 BR1.AC2
  Bottom 0.813: C4.1 27.94,35.08 v28.81,34.21
RX_N
  Top 0.254: J1.6 15.24,41.27 15.24,41.76 14.48,42.52 13.56,42.52 12.04,44.04 12.04,46.99 15.21,50.16 T1.9
RX_P
  Top 0.152: 18.62,48.03 18.53,48.03
  Top 0.254: 18.62,48.03 arc90 18.89,48.3 18.89,49.24 arc-90 19.15,49.51 19.24,49.51 arc-90 19.51,49.24 19.51,48.3 arc90 19.78,48.03 19.87,48.03 arc90 20.13,48.3 20.13,49.24 arc-90 20.4,49.51 20.49,49.51 arc-90 20.76,49.24 20.76,49.03 arc90 21.02,48.77 23.98,48.77 25.12,47.62 T1.11 | 18.53,48.03 arc-90 18.26,48.3 18.26,49.24 arc90 18,49.51 17.91,49.51 arc90 17.64,49.24 17.64,49.03 arc-90 17.37,48.77 14.59,48.77 12.55,46.72 12.55,45.24 J1.3
RXD  (via drill 0.25)
  Top 0.152: U3.32 v92.29,38.04 | v102.33,38.04 103.5,39.21 103.5,43.5 103.82,43.81 R25.2
  Bottom 0.152: v92.29,38.04 v102.33,38.04
RXIN
  Top 0.152: R25.1 J4.2
SCK  (via drill 0.25)
  Top 0.152: 91.12,50.65 U4.1 91.11,49.68 90.65,49.21 89.06,49.21 88.74,48.9 87.47,48.9 v87.15,48.58 | v87.47,45.72 87.47,43.34 85.8,41.67 U3.34
  Bottom 0.152: v87.15,48.58 87.15,46.04 v87.47,45.72
SPARE_0
  Top 0.813: J1.4 12.22,39.53 12.22,36.2 13.18,35.24 13.18,33.18 11.91,31.75 8.89,31.75 8.4,31.26 BR2.AC1
  Bottom 0.813: C2.1 22.38,35.08 21.75,34.45 13.97,34.45 12.22,36.2 12.22,39.53 J1.4 15.24,42.55 J1.5
SPARE_1
  Top 0.813: J1.8 15.08,37.62 15.08,30.48 14.66,30.06 BR2.AC2
  Bottom 0.61: 19.66,36.35 C1.1
  Bottom 0.813: J1.8 15.24,37.47 J1.7 17.62,36.35 19.66,36.35
SW1  (via drill 0.25)
  Top 0.152: SW1.1 36.51,31.47 SW1.2 40.92,31.47 42.39,30 57.47,30 v60.96,26.51 | R20.1 36.52,31.47 | U3.4 80.3,27.44 79.69,26.83 77.15,26.83 v76.83,26.51
  Top 0.254: 36.52,31.47 36.51,31.47
  Bottom 0.152: v60.96,26.51 v76.83,26.51
SW2  (via drill 0.25)
  Top 0.152: SW2.1 49.21,31.47 SW2.2 51.95,31.47 52.23,31.59 57.47,31.59 v61.91,27.15 | R21.1 49.21,31.47 | U3.3 79.8,27.57 79.38,27.15 v76.2,27.15
  Top 0.254: 49.21,31.47
  Bottom 0.152: v61.91,27.15 v76.2,27.15
TD_CT  (via drill 0.5)
  Top 0.152: 76.83,38.14 U3.49
  Top 0.203: U3.48 78.8,45.98 C21.1 | U3.49 74.04,38.04 C19.1 | U3.54 78.08,35.54 78.74,36.2 78.74,38.1 76.83,40.01 C17.1
  Top 0.406: C31.1 51.44,39.69 | T1.2 33.66,42.55 33.02,41.91 33.02,40.48 33.81,39.69 48.74,39.69 | 51.44,39.69 48.74,39.69 | R32.2 48.74,39.69 | R31.2 51.44,39.69 | 51.44,39.69 52.86,39.69 v53.34,40.16
  Top 0.61: 64.77,49.53 64.77,47.31 | 64.77,47.31 64.77,44.45 | 64.77,44.45 64.77,43.18 65.72,42.23 C18.1 C19.1 | C23.1 64.77,49.53 | C22.1 64.77,47.31 | C17.1 C16.1 72.7,42.23 71.75,43.18 71.75,46.04 70.48,47.31 64.77,47.31 | C21.1 C20.1 72.7,47.95 71.12,49.53 64.77,49.53 | L3.1 64.14,51.75 64.77,51.12 64.77,49.53 | v61.28,44.45 64.77,44.45
  Bottom 0.406: v53.34,40.16 53.34,41.75 56.04,44.45 v61.28,44.45
TD_N
  Top 0.152: R5.2 40.96,43.81 41.91,42.87 D5.2 43.5,42.87 44.45,43.81 R32.1 53.34,43.81 53.66,43.5 54.19,43.5 55.08,42.61 55.08,38.16 55.51,37.73 56.62,37.73 57.15,38.26 L5.2
TD_P
  Top 0.152: L4.2 57.15,36.83 56.62,37.36 55.3,37.36 54.77,37.88 54.77,42.48 54.08,43.18 53.66,43.18 53.34,42.87 R31.1 D5.3 44.13,42.86 43.5,42.23 41.91,42.23 40.96,41.27 R6.2
TDF_N
  Top 0.152: 62.55,37.78 C25.2 | L5.1 60.32,38.26 60.64,37.94 61.28,37.94 C25.2 | C25.2 66.51,37.94 66.99,37.46 75.68,37.46 75.76,37.54 U3.50
TDF_P
  Top 0.152: L4.1 60.33,36.83 60.49,36.99 C24.2 65.24,36.83 66.67,36.83 66.99,37.15 75.68,37.15 75.79,37.04 U3.51
TX_CT  (via drill 0.5)
  Top 0.61: 18.57,30.07 BR1.AC1
  Top 0.813: T1.15 27.3,42.55 27.94,41.91 27.94,35.72 26.04,33.81 | 26.04,33.81 25.56,33.34 19.53,33.34 18.57,32.38 18.57,30.07 | v25.24,34.61 26.04,33.81
  Bottom 0.813: C3.1 v25.24,34.61
TX_N
  Top 0.254: T1.14 24.92,43.81 22.38,46.35 J1.2
TX_P
  Top 0.254: T1.16 25.17,41.27 21.36,45.09 20.15,45.09 arc90 19.89,44.82 19.89,44.12 arc-90 19.62,43.85 19.58,43.85 arc-90 19.32,44.12 19.32,44.82 arc90 19.05,45.09 J1.1
TXD  (via drill 0.25)
  Top 0.152: U3.31 v92.94,37.54 | v103.42,37.54 104.86,37.54 R24.2 | v101.44,34.13 v101.44,36.83 | U5.2 98.9,25.56 v101.44,28.1
  Bottom 0.152: v92.94,37.54 101.44,37.54 | 101.44,37.54 v103.42,37.54 | v101.44,28.1 v101.44,34.13 | v101.44,36.83 101.44,37.54
TXOUT
  Top 0.152: R24.1 J4.1
VDDCORE
  Top 0.229: U3.10 83.3,27.51
  Top 0.254: 83.3,27.51 83.5,27.3 84.14,27.3 84.43,27.02 C26.1
VNNIN
  Top 0.254: 16.51,10.16 16.29,9.94 D2.C 16.29,3.91 TP3.1
  Top 0.813: L2.2 11.91,10.16 | D1.A 11.91,10.16 | 11.91,10.16 15.72,10.16 | C8.2 15.72,10.16 | 15.72,10.16 16.51,10.16 19.05,10.16 21.59,7.62 24.13,7.62 25.4,8.89 PS1.2
  Bottom 0.61: C10.2 26.67,5.71 25.4,6.99 PS1.2
VPPIN  (via drill 0.6)
  Top 0.254: R13.1 9.06,3.8 TP2.1 | D1.C v11.91,16.67 | U2.1 44.61,22.54 43.02,20.95 28.73,20.95 22.3,14.53
  Top 0.813: L1.2 11.91,15.24 | D1.C 11.91,15.24 | 11.91,15.24 15.72,15.24 | C8.1 15.72,15.24 | 15.72,15.24 21.59,15.24 22.3,14.53 22.86,13.97 PS1.1
  Bottom 0.254: v11.91,16.67 11.91,4.13 TP2.1
  Bottom 0.61: C35.2 24.13,2.54 22.86,3.81 PS1.1

### Text on the board
bNames: C13
_tsilk: TP1 | C32 | L3 | C15 | D6 | U4 | R7 | R34 | R33 | C23 | C20 | C21 | C33 | R28 | OSC1 | R8 | C22 | R5 | D5 | R25 | C27 | GND | R32 | C18 | C19 | C16 | C17 | J3 | R31 | RXI | R6 | TXO | T1 | L5 | C25 | C24 | J4 | C31 | R30 | D12 | R20 | R21 | L4 | C28 | R24 | D11 | R27 | R22 | J1 | C30 | SW1 | SW2 | R23 | U3 | C29 | D7 | D8 | D10 | R26 | * | D13 | R17 | R11 | C26 | R18 | R19 | U2 | C34 | C36 | BR2 | BR1 | TP6 | U6 | U5 | R9 | GND | PS1 | C37 | L1 | R10 | DATA | R12 | C7 | D1 | C8 | L2 | VIN+ | VIN- | ATDET | NC | NC | NC | -VDC | +VDC | ADJ | -VDC | PS2 | 24V | J2 | R13 | D2 | C38 | TP2 | TP3 | TP4 | TP5 | U1 | C9
_bsilk: C6 | C5 | R2 | R3 | R4 | GND | R1 | RXI | TXO | C1 | C2 | C3 | C4 | C14 | GND | D9 | DATA | C12 | D14 | C11 | VIN+ | VIN- | ATDET | NC | NC | NC | -VDC | +VDC | ADJ | -VDC | D3 | 24V | C10 | C35